# EAGLE schematic io-a-1 (EAGLE 9.6.2)
AUTHOR: Balazs Racz; DRAWING_TITLE: I/O daughterboard; LICENSE: Licensed by the Solderpad Hardware License V2.0; REVIEWER: n/a; REVISION: A; YEAR: 2023
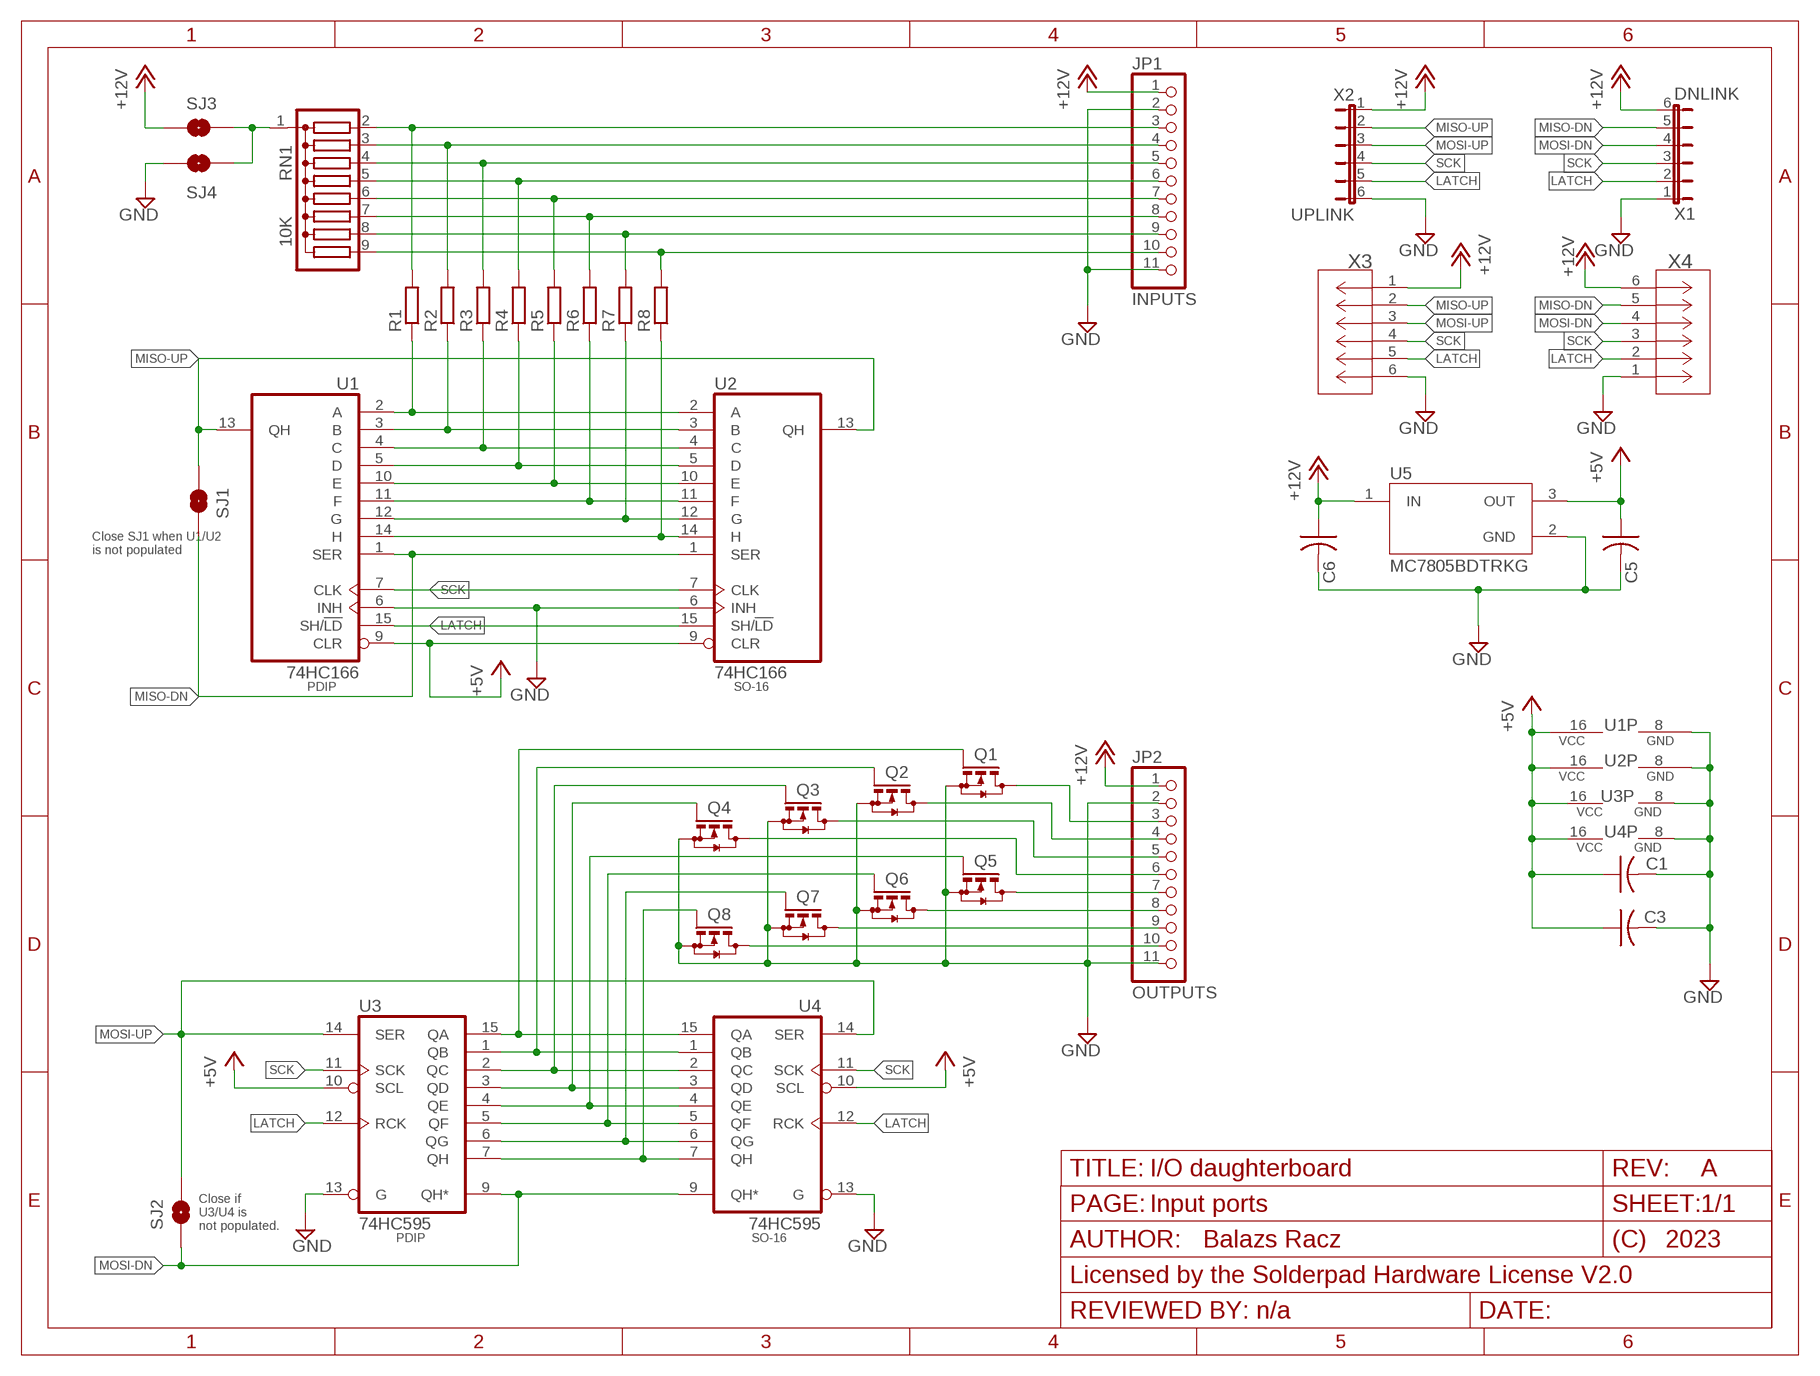
[diagram p0: schematic, sheet 1]
FRAME1 (FRAME_A_L): PAGE: Input ports
FRAME2 (FRAME_A_L): PAGE: Input ports

## Parts
C1  C-USC0805  [C0805]
C3  C-USC0805  [C0805]
C5  C-USC0805  [C0805]
C6  C-USC0805  [C0805]
JP1  INPUTS  PINHD-1X11  [1X11]
JP2  OUTPUTS  PINHD-1X11  [1X11]
Q1  BSS123  [SOT23]
Q2  BSS123  [SOT23]
Q3  BSS123  [SOT23]
Q4  BSS123  [SOT23]
Q5  BSS123  [SOT23]
Q6  BSS123  [SOT23]
Q7  BSS123  [SOT23]
Q8  BSS123  [SOT23]
R1  R-EU_R0805  [R0805]
R2  R-EU_R0805  [R0805]
R3  R-EU_R0805  [R0805]
R4  R-EU_R0805  [R0805]
R5  R-EU_R0805  [R0805]
R6  R-EU_R0805  [R0805]
R7  R-EU_R0805  [R0805]
R8  R-EU_R0805  [R0805]
RN1  10K  G08R  [SIL9]
SJ1  SJRND2  [SJ_RND2]
SJ2  SJRND2  [SJ_RND2]
SJ3  SJRND2  [SJ_RND2]
SJ4  SJRND2  [SJ_RND2]
U1  74HC166  74166N  [DIL16]
U2  74HC166  74166D  [SO16]
U3  74HC595  74HCT595N  [DIL16]
U4  74HC595  74HCT595D  [SO16]
U5  MC7805BDTRKG  [DPAK229P990X238-4N]
X1  DNLINK  JP6-FLAT  [JP6F]
X2  UPLINK  JP6-FLATFEMALE  [JP6F-FEM]
X3  MOLEX_530470610CON_530470610_MOL  [CON_530470610_MOL]
X4  MOLEX_530470610CON_530470610_MOL  [CON_530470610_MOL]

## Nets
+5V: C1.1 C3.1 C5.1 U1.9(CLR) U1.16(VCC) U2.9(CLR) U2.16(VCC) U3.10(SCL) U3.16(VCC) U4.10(SCL) U4.16(VCC) U5.3(OUT)
+12V: C6.1 JP1.1 JP2.1 SJ3.P$2 U5.1(IN) X1.6 X2.1 X3.1 X4.6
GND: C1.2 C3.2 C5.2 C6.2 JP1.2 JP1.11 JP2.2 JP2.11 Q1.2(S) Q2.2(S) Q3.2(S) Q4.2(S) Q5.2(S) Q6.2(S) Q7.2(S) Q8.2(S) SJ4.P$2 U1.6(INH) U1.8(GND) U2.6(INH) U2.8(GND) U3.8(GND) U3.13(G) U4.8(GND) U4.13(G) U5.2(GND) X1.1 X2.6 X3.6 X4.1
LATCH: U1.15(SH/!LD) U2.15(SH/!LD) U3.12(RCK) U4.12(RCK) X1.2 X2.5 X3.5 X4.2
MISO-DN: SJ1.P$1 U1.1(SER) U2.1(SER) X1.5 X4.5
MISO-UP: SJ1.P$2 U1.13(QH) U2.13(QH) X2.2 X3.2
MOSI-DN: SJ2.P$1 U3.9(QH*) U4.9(QH*) X1.4 X4.4
MOSI-UP: SJ2.P$2 U3.14(SER) U4.14(SER) X2.3 X3.3
N$1: RN1.1 SJ3.P$1 SJ4.P$1
N$19: JP2.6 Q4.3(D)
N$20: JP2.5 Q3.3(D)
N$21: JP2.4 Q2.3(D)
N$22: JP2.3 Q1.3(D)
N$27: JP1.3 R1.2 RN1.2
N$28: JP1.4 R2.2 RN1.3
N$29: JP1.5 R3.2 RN1.4
N$30: JP1.6 R4.2 RN1.5
N$31: JP1.7 R5.2 RN1.6
N$32: JP1.8 R6.2 RN1.7
N$33: JP1.9 R7.2 RN1.8
N$34: JP1.10 R8.2 RN1.9
N$35: JP2.7 Q5.3(D)
N$36: JP2.8 Q6.3(D)
N$37: JP2.9 Q7.3(D)
N$38: JP2.10 Q8.3(D)
PA: Q1.1(G) U3.15(QA) U4.15(QA)
PB: Q2.1(G) U3.1(QB) U4.1(QB)
PC: Q3.1(G) U3.2(QC) U4.2(QC)
PD: Q4.1(G) U3.3(QD) U4.3(QD)
PE: Q5.1(G) U3.4(QE) U4.4(QE)
PF: Q6.1(G) U3.5(QF) U4.5(QF)
PG: Q7.1(G) U3.6(QG) U4.6(QG)
PH: Q8.1(G) U3.7(QH) U4.7(QH)
QA: R1.1 U1.2(A) U2.2(A)
QB: R2.1 U1.3(B) U2.3(B)
QC: R3.1 U1.4(C) U2.4(C)
QD: R4.1 U1.5(D) U2.5(D)
QE: R5.1 U1.10(E) U2.10(E)
QF: R6.1 U1.11(F) U2.11(F)
QG: R7.1 U1.12(G) U2.12(G)
QH: R8.1 U1.14(H) U2.14(H)
SCK: U1.7(CLK) U2.7(CLK) U3.11(SCK) U4.11(SCK) X1.3 X2.4 X3.4 X4.3

## Notes on the sheet
- Close SJ1 when U1/U2
  is not populated
- PDIP | SO-16
- Close if
  U3/U4 is
  not populated.
- PDIP | SO-16

## Library data of the parts
C1 C3 C5 C6 = rcl:C-US: CAPACITOR, American symbol; SPICEPREFIX: C
JP1 JP2 = pinhead:PINHD-1X11: PIN HEADER
Q1-Q8 = transistor-small-signal:BSS123: N-CHANNEL MOS FET
R1-R8 = rcl:R-EU_: RESISTOR, European symbol; SPICEPREFIX: R
RN1 = resistor-sil:G08R: SIL RESISTOR; OC_FARNELL: unknown; OC_NEWARK: unknown
SJ1-SJ4 = trainlib:SJ: SMD solder JUMPER
U1 U2 = trainlib:74*166: 8-bit parallel load SHIFT REGISTER
U3 U4 = trainlib:74*595: 8-bit SHIFT REGISTER, output latch
U5 = MC7805BDTRKG:MC7805BDTRKG: Linear Voltage Regulator, Positive, 5.0 V, 1.0 A Vout: 5.0 V; TJ = -40°C to +125°C; MANUFACTURER: ON Semiconductor; PARTREV: 27; STANDARD: IPC-7351B
X1 X2 = eagleparts:JP6-FLAT
X3 X4 = eagleparts:MOLEX_530470610: Molex 1.25mm 6-positon PicoBlace connector. WM1735-ND https://www.digikey.com/en/products/detail/molex/0530470610/242857; COPYRIGHT: Copyright (C) 2023 Ultra Librarian. All rights reserved.; MANUFACTURER_PART_NUMBER: 530470610; MFR_NAME: Molex Connector Corporation